# Altium schematic sheet Server_CPU_Reset_IO.SchDoc
size D
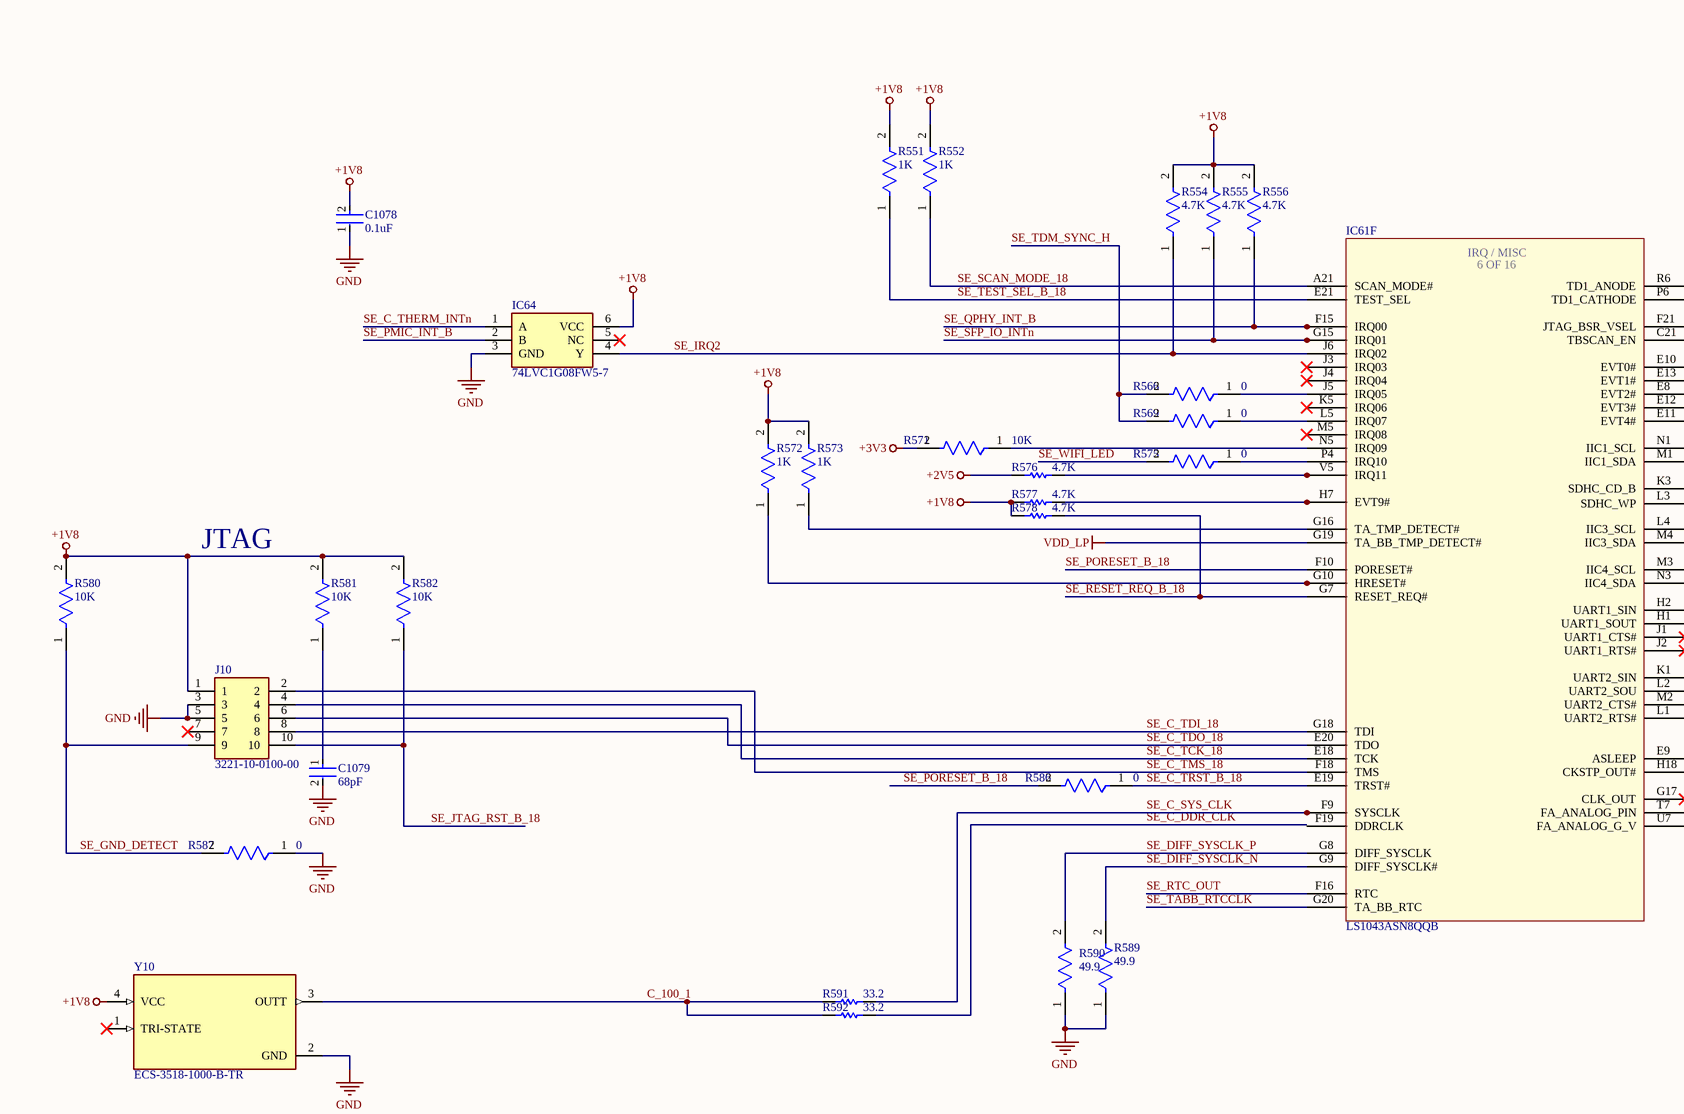
[diagram p0: Server_CPU_Reset_IO.SchDoc, top left]
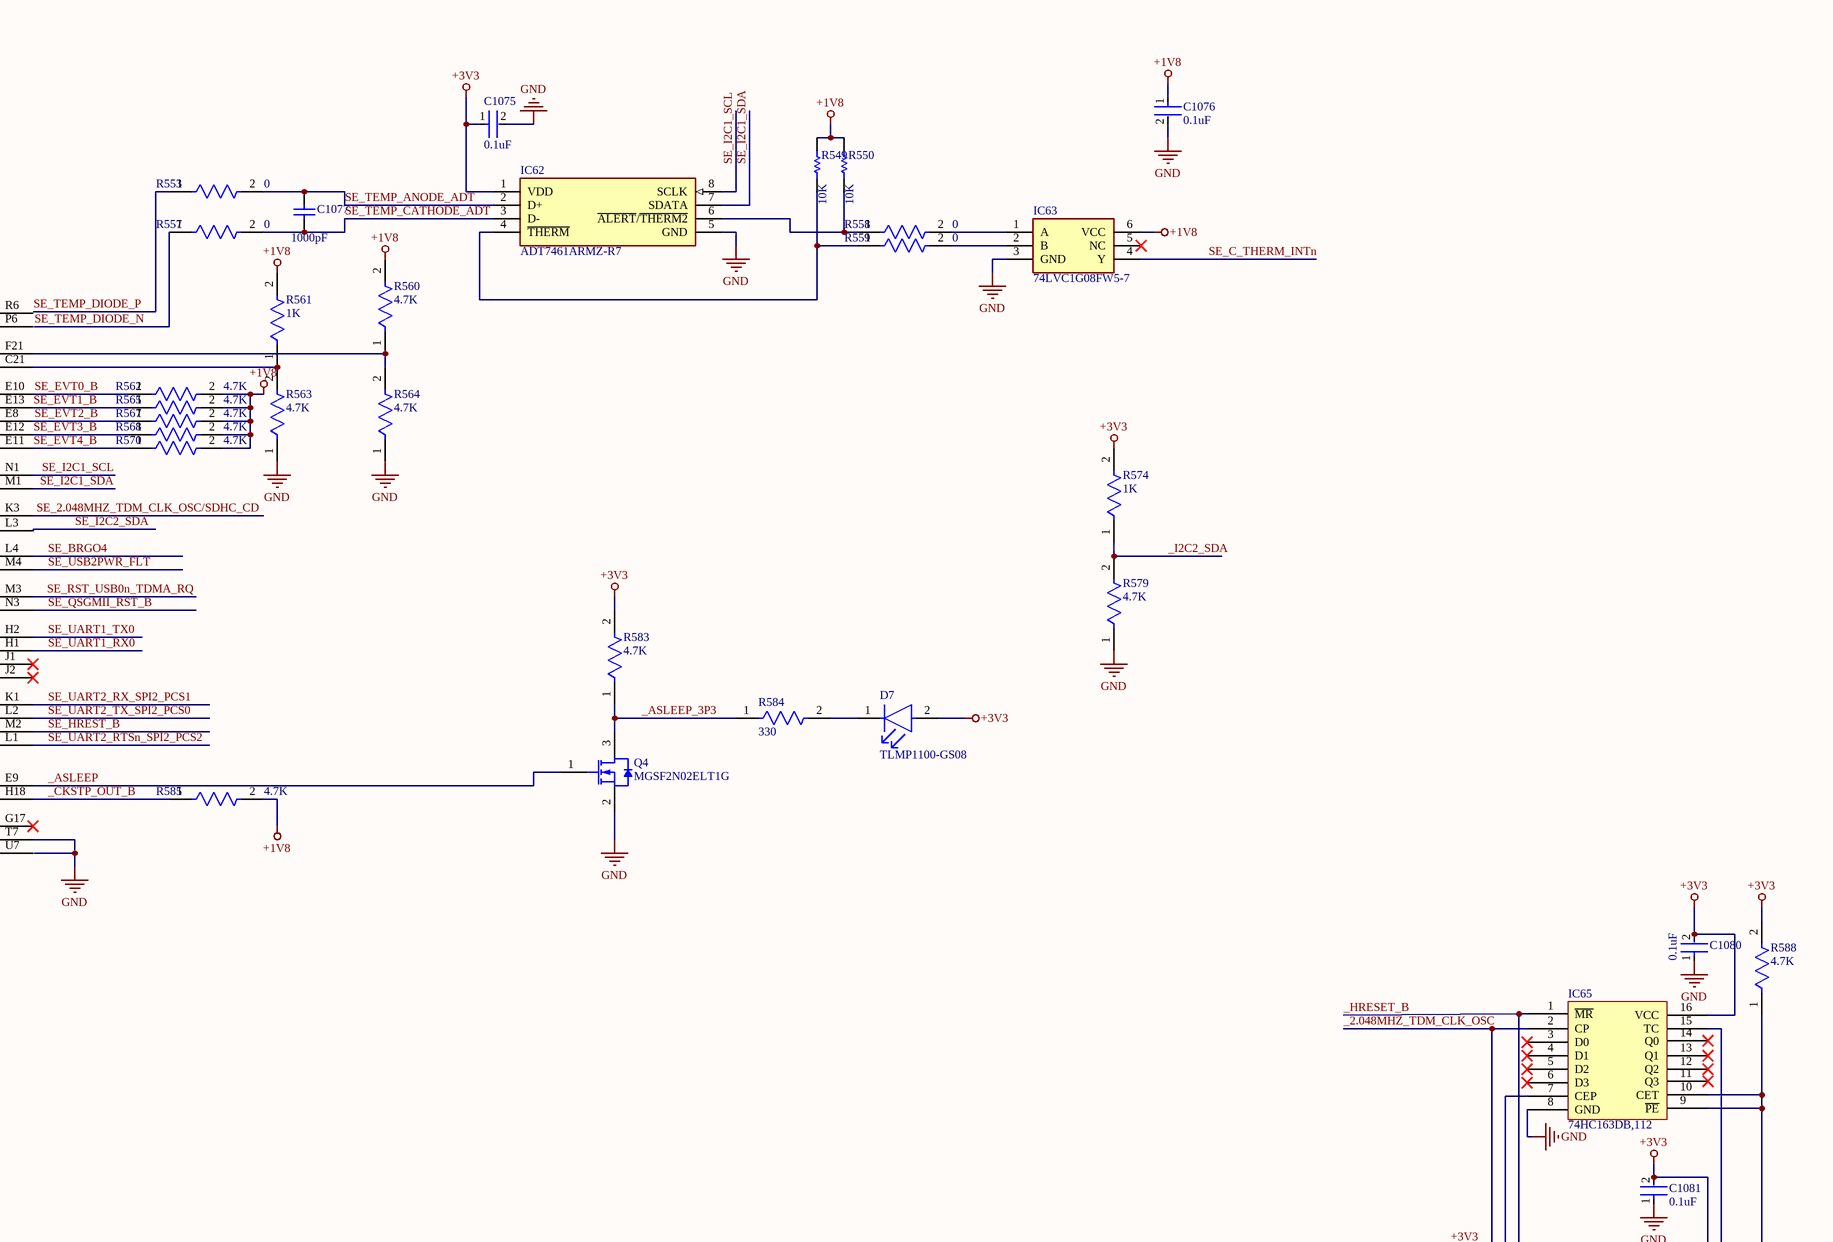
[diagram p1: Server_CPU_Reset_IO.SchDoc, top right]
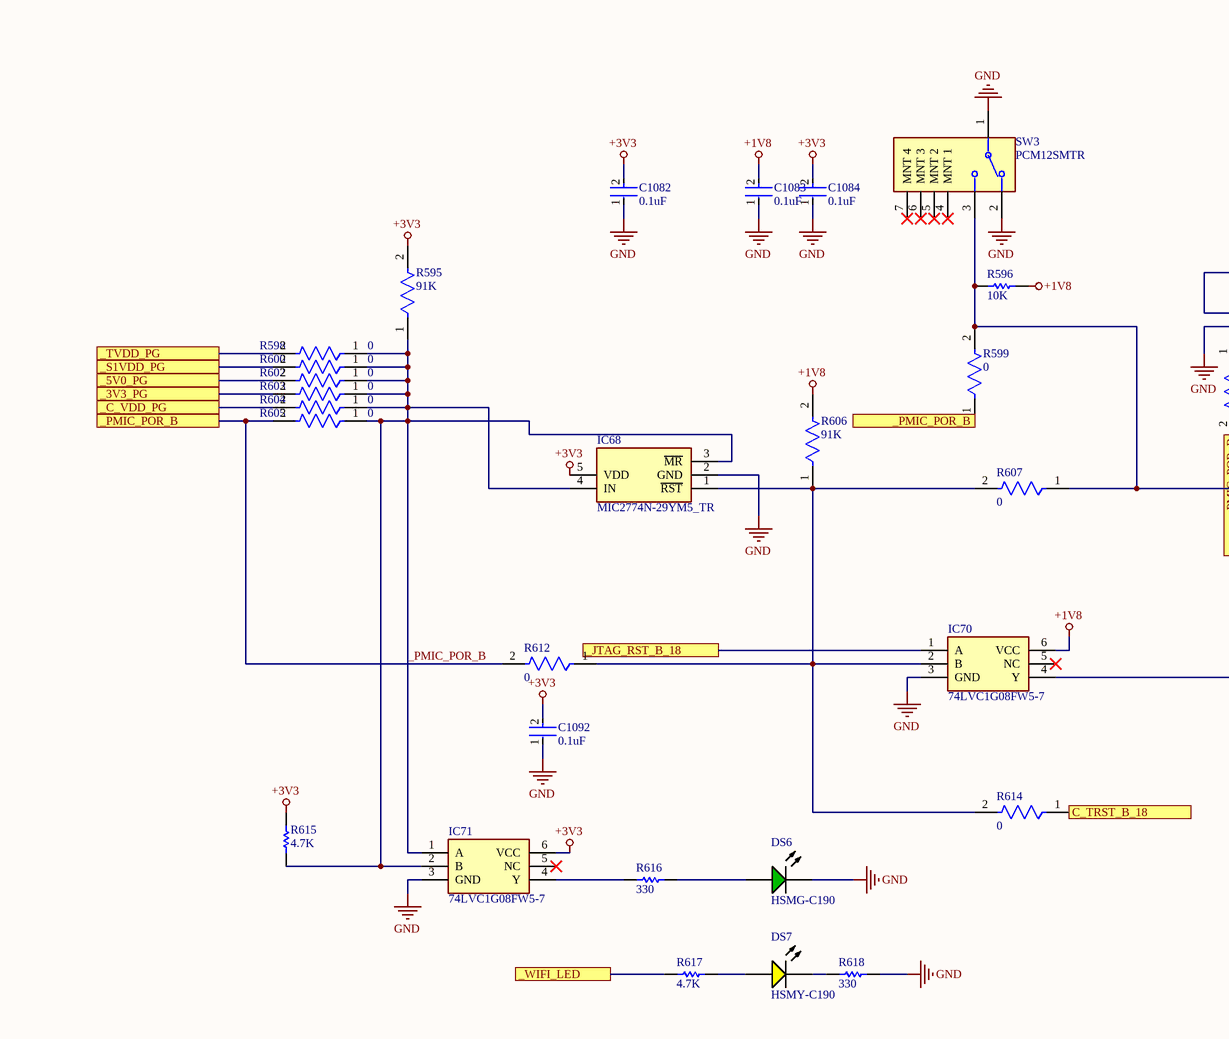
[diagram p2: Server_CPU_Reset_IO.SchDoc, bottom left]
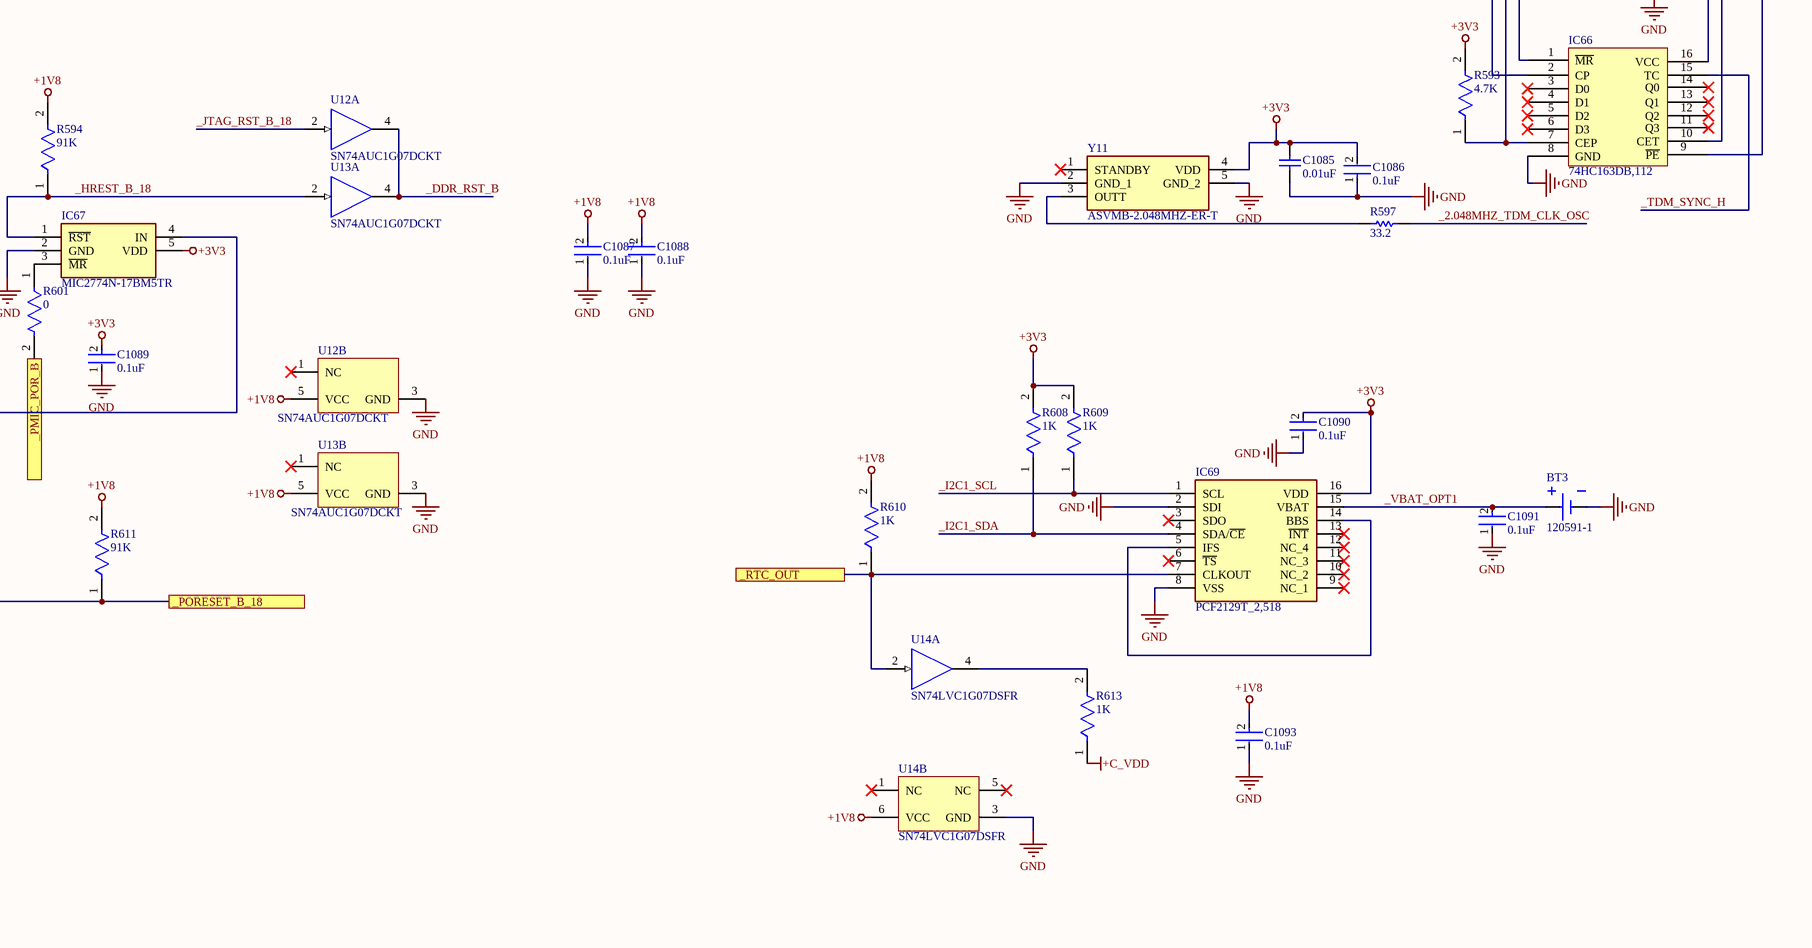
[diagram p3: Server_CPU_Reset_IO.SchDoc, bottom right]

## Parts
BT3  120591-1  [TECO-120591-1-2_V]
C1075  0.1uF  [FP-C0402-BB-MFG]
C1076  0.1uF  [FP-C0402-BB-MFG]
C1077  1000pF  [CAPC1005X55X25ML5T10]
C1078  0.1uF  [FP-GRM15-MFG]
C1079  68pF  [FP-C0805C-DN-MFG]
C1080  0.1uF  [FP-C0402-BB-MFG]
C1081  0.1uF  [FP-C0402-BB-MFG]
C1082  0.1uF  [FP-GRM15-MFG]
C1083  0.1uF  [FP-GRM15-MFG]
C1084  0.1uF  [FP-GRM15-MFG]
C1085  0.01uF  [CAPC1005X56X25LL10T15]
C1086  0.1uF  [FP-C0402-BB-MFG]
C1087  0.1uF  [FP-GRM15-MFG]
C1088  0.1uF  [FP-GRM15-MFG]
C1089  0.1uF  [FP-GRM15-MFG]
C1090  0.1uF  [FP-GRM15-MFG]
C1091  0.1uF  [FP-GRM15-MFG]
C1092  0.1uF  [FP-GRM15-MFG]
C1093  0.1uF  [FP-GRM15-MFG]
D7  TLMP1100-GS08  [FP-6_541-5056_01-4-MFG]
DS6  HSMG-C190  [AVAG-HSMX-C190_V]
DS7  HSMY-C190  [AVAG-HSMX-C190_V]
IC61  LS1043ASN8QQB  [BGA780C80P28X28_2300X2300X261]  (part F of 16)
IC62  ADT7461ARMZ-R7  [SOP65P490X110-8N]
IC63  74LVC1G08FW5-7  [74LVC1G08FW57]
IC64  74LVC1G08FW5-7  [74LVC1G08FW57]
IC65  74HC163DB,112  [SOP65P775X200-16N]
IC66  74HC163DB,112  [SOP65P775X200-16N]
IC67  MIC2774N-17BM5TR  [SOT95P280X145-5N]
IC68  MIC2774N-29YM5_TR  [SOT95P280X145-5N]
IC69  PCF2129T_2,518  [SOIC127P1032X265-16N]
IC70  74LVC1G08FW5-7  [74LVC1G08FW57]
IC71  74LVC1G08FW5-7  [74LVC1G08FW57]
J10  3221-10-0100-00  [CNC_3221-10-0100-00]
Q4  MGSF2N02ELT1G  [ONSC-SOT-23-3-318-08_V]
R549  10K  [RESC1005X40X25NL05T05]
R550  10K  [RESC1005X40X25NL05T05]
R551  1K  [FP-CRCW0402-e3-MFG]
R552  1K  [FP-CRCW0402-e3-MFG]
R553  0  [FP-CRCW0402-e3-IPC_C]
R554  4.7K  [FP-CRCW0402-e3-IPC_B]
R555  4.7K  [FP-CRCW0402-e3-IPC_B]
R556  4.7K  [FP-CRCW0402-e3-IPC_B]
R557  0  [FP-CRCW0402-e3-IPC_C]
R558  0  [FP-CRCW0402-e3-IPC_C]
R559  0  [FP-CRCW0402-e3-IPC_C]
R560  4.7K  [FP-CRCW0402-e3-IPC_B]
R561  1K  [FP-CRCW0402-e3-MFG]
R562  4.7K  [FP-CRCW0402-e3-IPC_B]
R563  4.7K  [FP-CRCW0402-e3-IPC_B]
R564  4.7K  [FP-CRCW0402-e3-IPC_B]
R565  4.7K  [FP-CRCW0402-e3-IPC_B]
R566  0  [FP-CRCW0402-e3-IPC_C]
R567  4.7K  [FP-CRCW0402-e3-IPC_B]
R568  4.7K  [FP-CRCW0402-e3-IPC_B]
R569  0  [FP-CRCW0402-e3-IPC_C]
R570  4.7K  [FP-CRCW0402-e3-IPC_B]
R571  10K  [FP-CRCW0402-e3-IPC_B]
R572  1K  [FP-CRCW0402-e3-MFG]
R573  1K  [FP-CRCW0402-e3-MFG]
R574  1K  [FP-CRCW0402-e3-MFG]
R575  0  [FP-CRCW0402-e3-IPC_C]
R576  4.7K  [RESC1005X40X25LL05T05]
R577  4.7K  [RESC1005X40X25LL05T05]
R578  4.7K  [RESC1005X40X25LL05T05]
R579  4.7K  [FP-CRCW0402-e3-IPC_B]
R580  10K  [FP-CRCW0402-e3-IPC_B]
R581  10K  [FP-CRCW0402-e3-IPC_B]
R582  10K  [FP-CRCW0402-e3-IPC_B]
R583  4.7K  [FP-CRCW0402-e3-IPC_B]
R584  330  [FP-CRCW0402-e3-MFG]
R585  4.7K  [FP-CRCW0402-e3-IPC_B]
R586  0  [FP-CRCW0402-e3-IPC_C]
R587  0  [FP-CRCW0402-e3-IPC_C]
R588  4.7K  [FP-CRCW0402-e3-IPC_B]
R589  49.9  [FP-CRCW0402-e3-MFG]
R590  49.9  [FP-CRCW0402-e3-MFG]
R591  33.2  [RESC1005X40X25LL05T05]
R592  33.2  [RESC1005X40X25LL05T05]
R593  4.7K  [FP-CRCW0402-e3-IPC_B]
R594  91K  [FP-CRCW0402-e3-IPC_B]
R595  91K  [FP-CRCW0402-e3-IPC_B]
R596  10K  [RESC1005X40X25NL05T05]
R597  33.2  [RESC1005X40X25ML05T05]
R598  0  [FP-CRCW0402-e3-IPC_C]
R599  0  [FP-CRCW0402-e3-IPC_C]
R600  0  [FP-CRCW0402-e3-IPC_C]
R601  0  [FP-CRCW0402-e3-IPC_C]
R602  0  [FP-CRCW0402-e3-IPC_C]
R603  0  [FP-CRCW0402-e3-IPC_C]
R604  0  [FP-CRCW0402-e3-IPC_C]
R605  0  [FP-CRCW0402-e3-IPC_C]
R606  91K  [FP-CRCW0402-e3-IPC_B]
R607  0  [FP-CRCW0402-e3-IPC_C]
R608  1K  [FP-CRCW0402-e3-MFG]
R609  1K  [FP-CRCW0402-e3-MFG]
R610  1K  [FP-CRCW0402-e3-MFG]
R611  91K  [FP-CRCW0402-e3-IPC_B]
R612  0  [FP-CRCW0402-e3-IPC_C]
R613  1K  [FP-CRCW0402-e3-MFG]
R614  0  [FP-CRCW0402-e3-IPC_C]
R615  4.7K  [RESC1005X40X25LL05T05]
R616  330  [RESC1608X55X30LL15T15]
R617  4.7K  [RESC1005X40X25LL05T05]
R618  330  [RESC1608X55X30LL15T15]
SW3  PCM12SMTR  [FP-PCM12SMTR-MFG]
U12  SN74AUC1G07DCKT  [DCK0005A_M]  (parts A,B of 2)
U13  SN74AUC1G07DCKT  [DCK0005A_M]  (parts A,B of 2)
U14  SN74LVC1G07DSFR  [DSF0006A_V]  (parts A,B of 2)
Y10  ECS-3518-1000-B-TR  [OSC_ECS-3518-1000-B-TR]
Y11  ASVMB-2.048MHZ-ER-T  [ASVMB2048MHZERT]

## Ports
_3V3_PG, _5V0_PG, _C_VDD_PG, _JTAG_RST_B_18, _PMIC_POR_B, _PORESET_B_18, _RTC_OUT, _S1VDD_PG, _TVDD_PG, _WIFI_LED, C_TRST_B_18

## Nets
+1V8: C1076.1 C1078.2 C1083.2 C1087.2 C1088.2 C1093.2 IC63.6(VCC) IC64.6(VCC) IC70.6(VCC) J10.1 R549.2 R550.2 R551.2 R552.2 R554.2 R555.2 R556.2 R560.2 R561.2 R562.2 R565.2 R567.2 R568.2 R570.2 R572.2 R573.2 R577.2 R578.2 R580.2 R581.2 R582.2 R585.2 R594.2 R596.1 R606.2 R610.2 R611.2 U12.5(VCC) U13.5(VCC) U14.6(VCC) Y10.4(VCC)
+2V5: R576.2
+3V3: C1075.1 C1080.2 C1081.2 C1082.2 C1084.2 C1085.2 C1086.2 C1089.2 C1090.2 C1092.2 D7.2(A) IC62.1(VDD) IC65.16(VCC) IC66.16(VCC) IC67.5(VDD) IC68.5(VDD) IC69.16(VDD) IC71.6(VCC) R571.2 R574.2 R583.2 R588.2 R593.2 R595.2 R608.2 R609.2 R615.2 Y11.4(VDD)
+C_VDD: R613.1
GND: BT3.2(-) C1075.2 C1076.2 C1078.1 C1079.2 C1080.1 C1081.1 C1082.1 C1083.1 C1084.1 C1085.1 C1086.1 C1087.1 C1088.1 C1089.1 C1090.1 C1091.1 C1092.1 C1093.1 DS6.2(K) IC61.T7(FA_ANALOG_PIN) IC62.5(GND) IC63.3(GND) IC64.3(GND) IC65.8(GND) IC66.8(GND) IC67.2(GND) IC68.2(GND) IC69.2(SDI) IC69.8(VSS) IC70.3(GND) IC71.3(GND) J10.3 J10.5 Q4.2(S) R563.1 R564.1 R579.1 R587.1 R589.1 R590.1 R618.2 SW3.1 SW3.2 U12.3(GND) U13.3(GND) U14.3(GND) Y10.2(GND) Y11.2(GND_1) Y11.5(GND_2)
VDD_LP: IC61.G19(TA_BB_TMP_DETECT#)
_2.048MHZ_TDM_CLK_OSC: IC65.2(CP) IC66.2(CP) R597.2
_3V3_PG: R603.2 ; port _3V3_PG
_5V0_PG: R602.2 ; port _5V0_PG
_ASLEEP: IC61.E9(ASLEEP) Q4.1(G)
_ASLEEP_3P3: Q4.3(D) R583.1 R584.1
_C_VDD_PG: R604.2 ; port _C_VDD_PG
_CKSTP_OUT_B: IC61.H18(CKSTP_OUT#) R585.1
_DDR_RST_B: U12.4(Y) U13.4(Y)
_HRESET_B: IC65.1(~{MR}) IC66.1(~{MR})
_HREST_B_18: IC67.1(~{RST}) R594.1 U13.2(A)
_I2C1_SCL: IC69.1(SCL) R609.1
_I2C1_SDA: IC69.4(SDA/~{CE}) R608.1
_I2C2_SDA: R574.1 R579.2
_JTAG_RST_B_18: IC70.1(A) ; port _JTAG_RST_B_18
_JTAG_RST_B_18: U12.2(A)  [a separate net that carries the same name]
_PMIC_POR_B: IC68.3(~{MR}) IC68.4(IN) IC71.1(A) IC71.2(B) R595.1 R598.1 R599.1 R600.1 R601.2 R602.1 R603.1 R604.1 R605.1 R605.2 R612.2 R615.1 ; port _PMIC_POR_B
_PORESET_B_18: IC70.4(Y) R611.1 ; port _PORESET_B_18
_RTC_OUT: IC69.7(CLKOUT) R610.1 U14.2(A) ; port _RTC_OUT
_S1VDD_PG: R600.2 ; port _S1VDD_PG
_TDM_SYNC_H: IC66.15(TC)
_TVDD_PG: R598.2 ; port _TVDD_PG
_VBAT_OPT1: BT3.1(+) C1091.2 IC69.15(VBAT)
_WIFI_LED: R617.2 ; port _WIFI_LED
C_100_1: R591.1 R592.1 Y10.3(OUTT)
C_TRST_B_18: R614.1 ; port C_TRST_B_18
SE_2.048MHZ_TDM_CLK_OSC/SDHC_CD: IC61.K3(SDHC_CD_B)
SE_BRGO4: IC61.L4(IIC3_SCL)
SE_C_DDR_CLK: R592.2
SE_C_SYS_CLK: IC61.F9(SYSCLK) R591.2
SE_C_TCK_18: IC61.E18(TCK) J10.4
SE_C_TDI_18: IC61.G18(TDI) J10.8
SE_C_TDO_18: IC61.E20(TDO) J10.6
SE_C_THERM_INTn: IC63.4(Y) IC64.1(A)
SE_C_TMS_18: IC61.F18(TMS) J10.2
SE_C_TRST_B_18: IC61.E19(TRST#) R586.1
SE_DIFF_SYSCLK_N: IC61.G9(DIFF_SYSCLK#) R589.2
SE_DIFF_SYSCLK_P: IC61.G8(DIFF_SYSCLK) R590.2
SE_EVT0_B: IC61.E10(EVT0#) R562.1
SE_EVT1_B: IC61.E13(EVT1#) R565.1
SE_EVT2_B: IC61.E8(EVT2#) R567.1
SE_EVT3_B: IC61.E12(EVT3#) R568.1
SE_EVT4_B: IC61.E11(EVT4#) R570.1
SE_GND_DETECT: J10.9 R580.1 R587.2
SE_HREST_B: IC61.M2(UART2_CTS#)
SE_I2C1_SCL: IC61.N1(IIC1_SCL) IC62.8(SCLK)
SE_I2C1_SDA: IC61.M1(IIC1_SDA) IC62.7(SDATA)
SE_I2C2_SDA: IC61.L3(SDHC_WP)
SE_IRQ2: IC61.J6(IRQ02) IC64.4(Y) R554.1
SE_JTAG_RST_B_18: J10.10 R582.1
SE_PMIC_INT_B: IC64.2(B)
SE_PORESET_B_18: IC61.F10(PORESET#) R586.2
SE_QPHY_INT_B: IC61.F15(IRQ00) R556.1
SE_QSGMII_RST_B: IC61.N3(IIC4_SDA)
SE_RESET_REQ_B_18: IC61.G7(RESET_REQ#) R578.1
SE_RST_USB0n_TDMA_RQ: IC61.M3(IIC4_SCL)
SE_RTC_OUT: IC61.F16(RTC)
SE_SCAN_MODE_18: IC61.A21(SCAN_MODE#) R552.1
SE_SFP_IO_INTn: IC61.G15(IRQ01) R555.1
SE_TABB_RTCCLK: IC61.G20(TA_BB_RTC)
SE_TDM_SYNC_H: R566.2 R569.2
SE_TEMP_ANODE_ADT: C1077.2 IC62.2(D+) R553.2
SE_TEMP_CATHODE_ADT: C1077.1 IC62.3(D-) R557.2
SE_TEMP_DIODE_N: R557.1
SE_TEMP_DIODE_P: R553.1
SE_TEST_SEL_B_18: IC61.E21(TEST_SEL) R551.1
SE_UART1_RX0: IC61.H1(UART1_SOUT)
SE_UART1_TX0: IC61.H2(UART1_SIN)
SE_UART2_RTSn_SPI2_PCS2: IC61.L1(UART2_RTS#)
SE_UART2_RX_SPI2_PCS1: IC61.K1(UART2_SIN)
SE_UART2_TX_SPI2_PCS0: IC61.L2(UART2_SOU)
SE_USB2PWR_FLT: IC61.M4(IIC3_SDA)
SE_WIFI_LED: R575.2
NetC1079_1: C1079.1 R581.1
NetD7_1: D7.1(C) R584.2
NetDS6_1: DS6.1(A) R616.2
NetDS7_1: DS7.1(A) R617.1
NetDS7_2: DS7.2(K) R618.1
NetIC61_C21: IC61.C21(TBSCAN_EN) R561.1 R563.2
NetIC61_F21: IC61.F21(JTAG_BSR_VSEL) R560.1 R564.2
NetIC61_G10: IC61.G10(HRESET#) R572.1
NetIC61_G16: IC61.G16(TA_TMP_DETECT#) R573.1
NetIC61_H7: IC61.H7(EVT9#) R577.1
NetIC61_J5: IC61.J5(IRQ05) R566.1
NetIC61_L5: IC61.L5(IRQ07) R569.1
NetIC61_N5: IC61.N5(IRQ09) R571.1
NetIC61_P4: IC61.P4(IRQ10) R575.1
NetIC61_V5: IC61.V5(IRQ11) R576.1
NetIC62_4: IC62.4(~{THERM}) R549.1 R559.1
NetIC62_6: IC62.6(~{ALERT}/~{THERM2}) R550.1 R558.1
NetIC63_1: IC63.1(A) R558.2
NetIC63_2: IC63.2(B) R559.2
NetIC65_7: IC65.7(CEP) IC66.7(CEP) R593.1
NetIC65_9: IC65.9(~{PE}) IC65.10(CET) IC66.9(~{PE}) R588.1
NetIC65_15: IC65.15(TC) IC66.10(CET)
NetIC67_3: IC67.3(~{MR}) R601.1
NetIC67_4: IC67.4(IN) R596.2 R599.2 R607.1 SW3.3
NetIC68_1: IC68.1(~{RST}) IC70.2(B) R606.1 R607.2 R612.1 R614.2
NetIC69_5: IC69.5(IFS) IC69.14(BBS)
NetIC71_4: IC71.4(Y) R616.1
NetR597_1: R597.1 Y11.3(OUTT)
NetR613_2: R613.2 U14.4(Y)

Not connected (* = marked no-connect by the designer): IC61 F19(DDRCLK) G17(CLK_OUT)* J1(UART1_CTS#)* J2(UART1_RTS#)* J3(IRQ03)* J4(IRQ04)* K5(IRQ06)* M5(IRQ08)* P6(TD1_CATHODE) R6(TD1_ANODE) U7(FA_ANALOG_G_V); IC63 5(NC)*; IC64 5(NC)*; IC65 3(D0)* 4(D1)* 5(D2)* 6(D3)* 11(Q3)* 12(Q2)* 13(Q1)* 14(Q0)*; IC66 3(D0)* 4(D1)* 5(D2)* 6(D3)* 11(Q3)* 12(Q2)* 13(Q1)* 14(Q0)*; IC69 3(SDO)* 6(~{TS})* 9(NC_1)* 10(NC_2)* 11(NC_3)* 12(NC_4)* 13(~{INT})*; IC70 5(NC)*; IC71 5(NC)*; J10 7*; SW3 4(MNT_1)* 5(MNT_2)* 6(MNT_3)* 7(MNT_4)*; U12 1(NC)*; U13 1(NC)*; U14 1(NC)* 5(NC)*; Y10 1(TRI-STATE)*; Y11 1(STANDBY)*

## Notes on the sheet
- JTAG
- Title
- Size:
- Date:
- File:
- D
- Number:
- Time:
- Revision:
- Sheet
- of
- (in symbol LS1043ASN8QQB, part F) IRQ / MISC; 6 OF 16

## Library data of the parts
BT3 = CMP-0438-00001-2: Lithium Battery Holder for CR2032 3V Cell; Manufacturer: TE Connectivity; Packing Type: Tray; Body Shape: Horizontal Cylindrical; AccessRights: 2147483647; RevisionId: 1; Folder: Unified Components\Components\TE Connectivity\Connectors & Connector Components\Power Products\Battery Interconnection Products\; ContentType: Unified Component; ContentTypeGUID: CB3C11C4-E317-11DF-B822-12313F0024A2; ComponentLink1Description: Manufacturer URL; LifeCycleStateGUID: 61E382EE-6656-4F12-9E24-BE9327104A25; FolderGUID: A6761B51-D489-48A3-9180-F4808F45AB79; PartNumber: 120591-1; LifeCycle: Released; ReleaseDate: 20/08/2013 02:50:22 AM; PackageReference: 120591-1; ComponentLink2URL: http://www.te.com/commerce/DocumentDelivery/DDEController?Action=showdoc&DocId=Customer+Drawing%7F120591%7FH%7Fpdf%7FEnglish%7FENG_CD_120591_H.pdf%7F120591-1; DatasheetVersion: Rev. H, 01/2013; PackageDescription: Lithium Battery Holder; ItemGUID: B2C50140-681E-4F62-8DBB-9728605318CE; ItemHRID: CMP-0438-00001; Mounting Technology: Through Hole; ComponentLink1URL: http://www.te.com/; ComponentLink2Description: Datasheet
C1075 C1076 C1080 C1081 C1086 = CMP-2008-02046-2: CAP CER 0.1UF 10V X5R 0402; Manufacturer: Kemet; Manufacturer Part Number: C0402C104K8PACTU; Material: Ceramic; Capacitance: 0.10 μF; Temperature Coefficient: 15%; Tolerance: 0.1; Value: 0.10 μF; Package: C0402-BB; Temperature: -55°C to +125°C; ComponentLink2Description: Datasheet; Temperature Characteristic: X5R; Device Class L1: Passive Components; Height: 0.55mm; Lead Free: Yes; ComponentLink2URL: https://content.kemet.com/datasheets/KEM_C1002_X7R_SMD.pdf; Device Class L2: Capacitors; Temperature Range Low: -55°C; Temperature Range High: +125°C; RoHS: TRUE; Octopart: https://octopart.com/c0402c104k8pactu-kemet-140039; Automotive: No; Mouser Description: Capacitor 100 nF 10 VDC 0402; Category: Cap; Voltage Rating: 10 V; Digikey Description: CAP CER 0.1UF 10V X5R 0402; Ipc Land Pattern Name: CAPC10050X50; Device Class L3: Ceramic Capacitors
C1077 = CMP-1662-00017-1: Chip Capacitor, 1 nF, +/- 10%, 50 V, -55 to 125 degC, 0402 (1005 Metric), RoHS, Tape and Reel; Case\/Package: 0402; Type (Capacitors): X7R; Voltage Rating (DC): 50 V; Capacitance: 1 nF; Width: 0.5 mm; Pins: 2; REACH SVHC: No SVHC; Length: 1 mm; Height: 0.5 mm; PackageDescription: 2-Pin Surface Mount Device, Body 1 x 0.5 mm; DatasheetVersion: 07/2016; Mount: Surface Mount; ComponentLink2Description: Datasheet; Tolerance: 10%; ComponentLink2URL: http://psearch.en.murata.com/capacitor/product/GRM155R71H102KA01%23.pdf; ComponentLink1URL: http://www.murata.com/; Case Code (Metric): 1005; Package Quantity: 10000; Min Operating Temperature: -55 degC; Max Operating Temperature: 125 degC; Voltage Rating: 50 V; ComponentLink1Description: Manufacturer URL; Packaging: Tape and Reel; Radiation Hardening: No; RoHSCompliant: true; PackageReference: 0402; Mounting Technology: Surface Mount; Case Code (Imperial): 0402
C1078 C1082-C1084 C1087-C1093 = CMP-2100-03641-2: CAP CER 0.1UF 16V X7R 0402; Manufacturer Part Number: GRM155R71C104KA88D; Manufacturer: Murata; Standoff Height: 0mm; Tolerance: 10%; Voltage Rating: 16Vdc; Material: Ceramic; Capacitance: 0.10μF; Value: 0.10μF; RoHS: TRUE; Temperature Characteristic: X7R; Octopart: https://octopart.com/grm155r71c104ka88d-murata-196880; Digikey Description: CAP CER 0.1UF 16V X7R 0402; Device Class L3: Ceramic Capacitors; Height: 0.55mm; ComponentLink2Description: Datasheet; Temperature Range Low: -55°C; Ipc Land Pattern Name: CAPC10050X219; ComponentLink2URL: https://search.murata.co.jp/Ceramy/image/img/A01X/G101/ENG/GRM155R71H471KA01-01A.pdf; Device Class L1: Passive Components; Lead Free: yes; Category: Cap; Package: GRM15; Temperature: -55°C to +125°C; Device Class L2: Capacitors; Temperature Range High: +125°C; Mouser Description: 0402 0.1 uF 16V ±10 % Tolerance X7R SMT Multilayer Ceramic Capacitor
C1079 = CMP-2007-00438-2: CAP CER 68PF 50V C0G/NP0 0805; Manufacturer Part Number: C0805C680J5GACTU; Manufacturer: KEMET; Temperature Coefficient: 30ppm/°C; Tolerance: 0.05; Temperature Characteristic: C0G; Material: Ceramic; ComponentLink2URL: https://content.kemet.com/datasheets/KEM_C1003_C0G_SMD.pdf; Device Class L1: Passive Components; Device Class L2: Capacitors; Capacitance: 68 pF; Value: 68 pF; Category: Cap; Octopart: https://octopart.com/c0805c680j5gactu-kemet-130145; Digikey Description: CAP CER 68PF 50V C0G/NP0 0805; Voltage Rating: 50 V; Ipc Land Pattern Name: CAPC200125X78; Lead Free: Yes; RoHS: TRUE; Device Class L3: Ceramic Capacitors; Mouser Description: Multilayer Ceramic Capacitors MLCC - SMD/SMT 50volts 68pF C0G 5%; Temperature Range High: +125°C; Temperature Range Low: -55°C; Height: 0.88mm; Temperature: -55°C to +125°C; ComponentLink2Description: Datasheet; Automotive: No; Package: C0805C-DN
C1085 = CMP-2008-02796-1: Manufacturer: AVX Interconnect / Elco; Part Number: 0402YC103JAT2A
D7 = CMP-02520-000009-1: LED GREEN 0603 SMD; Manufacturer: Vishay; Max Junction Temp: +120°C; Automotive Grade: Grade 3; Reverse Voltage: 6V; Led Orientation: Top View; Forward Voltage: 2.1V; Luminous Intensity: 15mcd; Forward Current: 20mA; Colour: Pure green; Peak Emmision Wavelength: 562nm; Wavelength: 561nm; Viewing Angle: 160°; Power Dissipation: 90mW; Digikey Description: LED GREEN 0603 SMD; Package: 6.541-5056.01-4; Ambient Temperature Range High: +100°C; Height: 0.65mm; Device Class L1: Optoelectronics; Device Class L2: LEDs; Mouser Description: Standard LEDs - SMD Pure Green; Temperature Range High: +120°C; RoHS: TRUE; Ambient Temperature Range Low: -40°C; Temperature: to +120°C; Manufacturer Part Number: TLMP1100-GS08; ComponentLink2URL: http://www.vishay.com/docs/83173/tlmb1100.pdf; Lead Free: Yes; Octopart: https://octopart.com/tlmp1100-gs08-vishay-55433993; Automotive: Yes; Device Class L3: unset; ComponentLink2Description: Datasheet; Category: Diode
DS6 = CMP-1744-00002-1: Chip LED, Green, 2.2 V, -40 to 85 degC, 2-Pin SMD, RoHS, Tape and Reel; Frequency: 400 KHz; Max Supply Voltage: 5.5 V; Access Time: 3500 ns; Clock Frequency: 100 KHz; Case\Package: SOIC; Density: 32 kb; Nominal Supply Current: 2 mA; Interface: Serial; Min Supply Voltage: 1.7 V; Packaging: Tape and Reel; PackageReference: HSMX-C190; ComponentLink2URL: http://docs.avagotech.com/docs/AV02-0551EN; RoHSCompliant: true; Pins: 8; REACH SVHC: No SVHC; Max Operating Temperature: 85 degC; Width: 4 mm; Radiation Hardening: No; Package Quantity: 3000; ComponentLink3Description: Package Specification; ComponentLink1Description: Manufacturer URL; Min Operating Temperature: -40 degC; PackageDescription: 2-Pin Surface Mount Device, Body 1.6 x 0.8 mm, Height 0.9 mm; Max Clock Frequency: 100 KHz; Height: 1.5 mm; ComponentLink1URL: http://www.avagotech.com/; DatasheetVersion: Mar-12; ComponentLink2Description: Datasheet; Mount: Surface Mount; Length: 5 mm; ComponentLink3URL: http://www.fairchildsemi.com/dwg/MA/MA03D.pdf
DS7 = CMP-1744-00003-1: LED Uni-Color Yellow, 65 mW, 20 mA, -40 to 85 degC, 2-Pin SMD, RoHS, Tape and Reel; Tolerance: 1%; Voltage Rating: 50 V; Power Rating: 100 mW; Case\Package: 0603; Resistance: 390 Ohm; Min Operating Temperature: -55 degC; Length: 1.6 mm; ComponentLink3Description: Package Specification; Mount: Surface Mount; PackageReference: HSMX-C190; ComponentLink2Description: Datasheet; DatasheetVersion: Mar-12; Case Code (Metric): 1608; Pins: 2; Package Quantity: 5000; ComponentLink2URL: http://docs.avagotech.com/docs/AV02-0551EN; ComponentLink1Description: Manufacturer URL; RoHSCompliant: true; Packaging: Tape and Reel; PackageDescription: 2-Pin Surface Mount Device, Body 1.6 x 0.8 mm, Height 0.9 mm; REACH SVHC: No SVHC; ComponentLink3URL: http://www.fairchildsemi.com/dwg/MA/MA03D.pdf; Voltage Rating (DC): 50 V; Width: 0.8 mm; ComponentLink1URL: http://www.avagotech.com/; Max Operating Temperature: 155 degC; Case Code (Imperial): 0603; Height: 0.45 mm
IC61 = LS1043ASN8QQB: Integrated Circuit; Manufacturer_Name: NXP; Datasheet Link: http://www.nxp.com/secured/assets/documents/en/data-sheet/LS1088A.pdf; Height: 2.61mm; Manufacturer_Part_Number: LS1043ASN8QQB; Mouser Part Number: 771-LS1043ASN8QQB; Mouser Price/Stock: https://www.mouser.co.uk/ProductDetail/NXP-Semiconductors/LS1043ASN8QQB/?qs=AQlKX63v8RsTATOTx7X0Jg%3D%3D
IC62 = ADT7461ARMZ-R7: Integrated Circuit; Manufacturer_Name: ON Semiconductor; Datasheet Link: http://www.onsemi.com/pub/Collateral/ADT7461-D.PDF; Height: 1.1mm; Manufacturer_Part_Number: ADT7461ARMZ-R7; Mouser Part Number: 863-ADT7461ARMZ-R7; Mouser Price/Stock: https://www.mouser.co.uk/ProductDetail/ON-Semiconductor/ADT7461ARMZ-R7/?qs=t2BMfLoP1KTcbdCoNjA9Gw%3D%3D; Arrow Part Number: ADT7461ARMZ-R7; Arrow Price/Stock: https://www.arrow.com/en/products/adt7461armz-r7/on-semiconductor
IC63 IC64 IC70 IC71 = 74LVC1G08FW5-7: Integrated Circuit; Manufacturer_Name: Diodes Inc.; Datasheet Link: https://www.diodes.com/assets/Datasheets/74LVC1G08.pdf; Height: 0.5mm; Manufacturer_Part_Number: 74LVC1G08FW5-7; Mouser Part Number: 621-74LVC1G08FW5-7; Mouser Price/Stock: https://www.mouser.co.uk/ProductDetail/Diodes-Incorporated/74LVC1G08FW5-7?qs=mYAa4mSiDJyHmkX79TXrAg%3D%3D; Arrow Part Number: 74LVC1G08FW5-7; Arrow Price/Stock: https://www.arrow.com/en/products/74lvc1g08fw5-7/diodes-incorporated
IC65 IC66 = 74HC163DB,112: Integrated Circuit; Manufacturer_Name: Nexperia; Datasheet Link: https://assets.nexperia.com/documents/data-sheet/74HC_HCT163.pdf; Height: 2mm; Manufacturer_Part_Number: 74HC163DB,112; Mouser Part Number: 771-HC163DB112; Mouser Price/Stock: https://www.mouser.com/Search/Refine.aspx?Keyword=771-HC163DB112; Arrow Part Number: 74HC163DB,112; Arrow Price/Stock: https://www.arrow.com/en/products/74hc163db112/nexperia
IC67 = MIC2774N-17BM5TR: Integrated Circuit; Manufacturer_Name: Microchip; Datasheet Link: http://ww1.microchip.com/downloads/en/DeviceDoc/mic2774.pdf; Height: 1.45mm; Manufacturer_Part_Number: MIC2774N-17BM5TR
IC68 = MIC2774N-29YM5_TR: Integrated Circuit; Manufacturer_Name: Microchip; Manufacturer_Part_Number: MIC2774N-29YM5 TR; Datasheet Link: https://eu.mouser.com/datasheet/2/268/mic2774-1891105.pdf; Height: 1.45mm
IC69 = PCF2129T_2,518: Integrated Circuit; Manufacturer_Name: NXP; Manufacturer_Part_Number: PCF2129T/2,518; Datasheet Link: http://www.nxp.com/docs/en/data-sheet/PCF2129.pdf; Height: 2.65mm; Mouser Part Number: 771-PCF2129T/2,518; Mouser Price/Stock: https://www.mouser.co.uk/ProductDetail/NXP-Semiconductors/PCF2129T-2518/?qs=O0BhuZj9Wkzo98h9NloC7Q%3D%3D; Arrow Part Number: PCF2129T/2,518; Arrow Price/Stock: https://www.arrow.com/en/products/pcf2129t2518/nxp-semiconductors
J10 = 3221-10-0100-00: Idc Box Header .050" 10pos; MF: {'manufacturer': u'CNC Tech'}; Value: *; Package: None; Price: None; MP: 3221-10-0100-00; Availability: Unavailable
Q4 = CMP-1058-00775-1: Power MOSFET, 2.8 A, 20 V, N-Channel, 3-Pin SOT-23, Pb-Free, Tape and Reel; Manufacturer: On Semiconductor; Crss Typ (pF): 45; Configuration: Single; V(BR)DSS Min (V): 20; ID Max (A): 2.8; Channel Polarity: N Channel; Ciss Typ (pF): 150; PD Max (W): 1.25; VGS Max (V): 8; Qrr Typ (nC): 200; Coss Typ (pF): 130; VGS(th) Max (V): 1; PartNumber: MGSF2N02ELT1G; ComponentLink3Description: Package Specification; ComponentLink1URL: http://www.onsemi.com/; ComponentLink3URL: http://www.onsemi.cn/pub_link/Collateral/318-08.PDF; DatasheetVersion: Rev. 3; Mounting Technology: Surface Mount; PackageVersion: Rev. AP, 11/2009; PackageDescription: 3-Pin Small Outline Transistor, Body 2.92 x 1.3 mm, Pitch 0.95 mm; ComponentLink1Description: Manufacturer URL; ComponentLink2URL: http://www.onsemi.cn/pub_link/Collateral/MGSF2N02EL-D.PDF; RoHS: Pb-Free; ComponentLink2Description: Datasheet; PackageReference: SOT-23-3-318-08; Package Type: SOT-23-3; Packing: Tape and Reel
R549 R550 = CMP-2002-01183-1: Part Number: ERT-J0ER103J; Manufacturer: Panasonic
R551 R552 R561 R572-R574 R608-R610 R613 = CMP-2002-08276-2: RES Thick Film, 1kΩ, 1%, 0.063W, 100ppm/°C, 0402; Resistance: 1kR; Power Rating: 63mW; Voltage Rating (DC): 50V; Package Quantity: 10; Termination: SMD/SMT; Width: 0.5mm; Military Standard: Not; Length: 1mm; Contact Plating: Tin; Mount: Surface Mount; Packaging: Tape and Reel; Case Code (Imperial): 0402; Tolerance: 1%; Weight: 2.3E-05oz; Number of Pins: 2; Case/Package: 0402; Case Code (Metric): 1005; Lead Free: Lead Free; Number of Terminations: 2; Max Power Dissipation: 63mW; Depth: 0.5mm; Temperature Coefficient: 100ppm/°C; Max Operating Temperature: 155°C; Height: 0.35mm; Features: Automotive AEC-Q200; Composition: Thick Film; Radiation Hardening: No; Voltage Rating: 50V; Min Operating Temperature: -55°C
R553 R557-R559 R566 R569 R575 R586 R587 R598-R605 R607 R612 R614 = CMP-2002-08122-2: RES Thick Film, 0Ω, 0.063W, 0402; Tolerance: 5%; Max Power Dissipation: 63mW; Voltage Rating: 50V; Temperature Coefficient: 100ppm/°C; Resistance: 0mR; Contact Plating: Tin; Height: 0.35mm; Radiation Hardening: No; Features: Automotive AEC-Q200; Composition: Thick Film; Width: 0.5mm; Weight: 2.3E-05oz; Termination: SMD/SMT; Packaging: Tape and Reel; Mount: Surface Mount; Case Code (Metric): 1005; Military Standard: Not; Min Operating Temperature: -55°C; Number of Terminations: 2; Package Quantity: 1; Case Code (Imperial): 0402; Depth: 0.5mm; Max Operating Temperature: 155°C; Case/Package: 0402; Power Rating: 63mW; Lead Free: Lead Free; Voltage Rating (DC): 50V; Length: 1mm
R554-R556 R560 R562-R565 R567 R568 R570 R579 R583 R585 R588 R593 = CMP-2002-00051-3: RES Thick Film, 4.7kΩ, 1%, 0.063W, 100ppm/°C, 0402; Voltage Rating (DC): 50V; Power Rating: 63mW; Resistance: 4.7kR; Termination: SMD/SMT; Military Standard: Not; Length: 1mm; Radiation Hardening: No; Max Operating Temperature: 155°C; Min Operating Temperature: -55°C; Package Quantity: 10; Width: 0.5mm; Case Code (Imperial): 0402; Number of Terminations: 2; Max Power Dissipation: 63mW; Tolerance: 1%; Features: Automotive AEC-Q200; Composition: Thick Film; Depth: 0.5mm; Mount: Surface Mount; Weight: 2.3E-05oz; Lead Free: Lead Free; Case/Package: 0402; Height: 0.35mm; Packaging: Tape and Reel; Temperature Coefficient: 100ppm/°C; Case Code (Metric): 1005; Voltage Rating: 50V; Contact Plating: Tin
R571 R580-R582 = CMP-2002-08136-3: RES Thick Film, 10kΩ, 5%, 0.063W, 200ppm/°C, 0402; Voltage Rating: 50V; Power Rating: 63mW; Resistance: 10kR; Military Standard: Not; Packaging: Tape and Reel; Case Code (Imperial): 0402; Min Operating Temperature: -55°C; Case Code (Metric): 1005; Case/Package: 0402; Temperature Coefficient: 200ppm/°C; Termination: SMD/SMT; Composition: Thick Film; Depth: 0.5mm; Number of Terminations: 2; Contact Plating: Tin; Height: 0.016inch; Width: 0.5mm; Max Operating Temperature: 155°C; Features: Automotive AEC-Q200; Length: 1mm; Radiation Hardening: No; Max Power Dissipation: 63mW; Mount: Surface Mount; Tolerance: 5%; Package Quantity: 1; Weight: 2.3E-05oz
R576-R578 R615 R617 = CMP-2002-01154-4: Chip Resistor, 4.7 KOhm, +/- 1%, 0.1 W, -55 to 155 degC, 0402 (1005 Metric), RoHS, Tape and Reel; PartNumber: ERJ-2RKF4701X; Voltage Rating: 50 V; Case\/Package: 0402; Power Rating: 100 mW; Height: 0.35 mm; Mounting Technology: Surface Mount; REACH SVHC: Yes; Resistance: 4.7 KOhm; Max Operating Temperature: 155 degC; ComponentLink1Description: Manufacturer URL; ComponentLink2Description: Datasheet; Pins: 2; PackageReference: 0402; Tolerance: 1%; Case Code (Imperial): 0402; Length: 1 mm; PackageDescription: 2-Pin Surface Mount Device, Body 1 x 0.5 mm; RoHSCompliant: true; Package Quantity: 1; Radiation Hardening: No; DatasheetVersion: 04/2015; Width: 0.5 mm; Case Code (Metric): 1005; Mount: Surface Mount; ComponentLink1URL: http://www.panasonic.com/; Min Operating Temperature: -55 degC; Packaging: Cut Tape; ComponentLink2URL: http://industrial.panasonic.com/cdbs/www-data/pdf/RDA0000/AOA0000C86.pdf
R584 = CMP-2002-08523-2: RES Thick Film, 330Ω, 1%, 0.063W, 100ppm/°C, 0402; Max Power Dissipation: 63mW; Voltage Rating (DC): 50V; Resistance: 330R; Case/Package: 0402; Packaging: Tape and Reel; Width: 0.5mm; Case Code (Metric): 1005; Radiation Hardening: No; Military Standard: Not; Contact Plating: Tin; Temperature Coefficient: 100ppm/°C; Lead Free: Lead Free; Power Rating: 63mW; Voltage Rating: 50V; Tolerance: 1%; Features: Automotive AEC-Q200; Case Code (Imperial): 0402; Composition: Thick Film; Weight: 2.3E-05oz; Package Quantity: 10; Min Operating Temperature: -55°C; Height: 0.35mm; Length: 1mm; Termination: SMD/SMT; Number of Terminations: 2; Depth: 0.5mm; Max Operating Temperature: 155°C
R589 R590 = CMP-1011-00363-3: RES Thick Film, 49.9Ω, 1%, 0.063W, 100ppm/°C, 0402; Resistance: 49.9R; Voltage Rating: 50V; Power Rating: 63mW; Temperature Coefficient: 100ppm/°C; Packaging: Tape and Reel; Height: 0.35mm; Length: 1mm; Case Code (Metric): 1005; Weight: 2.3E-05oz; Case Code (Imperial): 0402; Voltage Rating (DC): 50V; Composition: Thick Film; Lead Free: Lead Free; Package Quantity: 10; Number of Terminations: 2; Width: 0.5mm; Max Operating Temperature: 155°C; Depth: 0.5mm; Max Power Dissipation: 63mW; Tolerance: 1%; Radiation Hardening: No; Features: Automotive AEC-Q200; Min Operating Temperature: -55°C; Contact Plating: Tin; Mount: Surface Mount; Military Standard: Not; Termination: SMD/SMT; Case/Package: 0402
R591 R592 = CMP-2002-08532-1: Part Number: CRCW040233R2FKED; Manufacturer: Vishay Dale
R594 R595 R606 R611 = CMP-2002-00270-2: RES Thick Film, 91kΩ, 1%, 0.063W, 100ppm/°C, 0402; Power Rating: 63mW; Voltage Rating: 50V; Resistance: 91kR; Packaging: Tape and Reel; Max Operating Temperature: 155°C; Height: 0.35mm; Radiation Hardening: No; Tolerance: 1%; Number of Terminations: 2; Width: 0.02inch; Length: 1mm; Temperature Coefficient: 100ppm/°C; Features: Automotive AEC-Q200; Voltage Rating (DC): 50V; Weight: 2.3E-05oz; Min Operating Temperature: -55°C; Military Standard: Not; Max Power Dissipation: 63mW; Number of Pins: 2; Composition: Thick Film; Lead Free: Lead Free; Contact Plating: Tin; Case/Package: 0402; Termination: SMD/SMT; Package Quantity: 10; Case Code (Metric): 1005; Case Code (Imperial): 0402; Depth: 0.5mm
R596 = CMP-2002-08143-1: Part Number: CRCW040210R0FKED; Manufacturer: Vishay Dale
R597 = CMP-2002-08529-1: Manufacturer: Vishay Dale; Part Number: CRCW040233K2FKED
R616 R618 = CMP-2000-00435-2: Chip Resistor, 330 Ohm, +/- 1%, 0.1 W, -55 to 155 degC, 0603 (1608 Metric), RoHS, Tape and Reel; Gender: Male; Mating Cycles: 10000; Current Rating: 500 mA; Voltage Rating: 10 V; REACH SVHC: No SVHC; PackageDescription: 2-Pin Surface Mount Device, Body 1.6 x 0.85 mm; Contact Finish: Gold; Pins: 8; ComponentLink1Description: Manufacturer URL; Packaging: Tape and Reel; Max Operating Temperature: 85 degC; Contact Material: Copper; Height: 1.45 mm; Width: 1.45 mm; DatasheetVersion: Apr-15; Package Quantity: 1500; Contact Plating: Gold; PackageReference: 0603; Mount: Surface Mount; Lead Pitch: 1.1 mm; Min Operating Temperature: -25 degC; ComponentLink1URL: http://www.panasonic.com/; ComponentLink2URL: http://industrial.panasonic.com/cdbs/www-data/pdf/RDA0000/AOA0000C86.pdf; Length: 13.7 mm; ComponentLink2Description: Datasheet; RoHSCompliant: true
SW3 = CMP-2000-06884-2: SWITCH SLIDE SPDT 300MA 6V; Actuator Material: Nylon; Switch Function: On-On; Insulation Resistance: 100mR; Actuator Type: Standard; Mechanical Life: 10000Cycles; Actuator Length: 1.5mm; Contact Resistance: 70mR; Min Operating Temperature: -20°C; Max Current Rating: 300mA; Max Voltage Rating (DC): 6V; Package Quantity: 1; Mount: Surface Mount; Packaging: Tape and Reel; Contact Plating: Silver; Depth: 5mm; REACH SVHC: No SVHC; Voltage Rating (DC): 6V; Voltage Rating (AC): 6V; Max Operating Temperature: 85°C; Length: 7.7mm; Termination: Gull Wing; Current Rating: 300mA; Contact Current Rating: 300mA; Orientation: Right Angle; Width: 6.7mm; Switch Travel: 1.5mm; Lead Free: Lead Free; Contact Material: Copper Alloy; Throw Configuration: SPDT
U12 U13 = CMP-0859-00406-3: Single Buffer/Driver With Open-Drain Output, DCK0005A, SMALL T&R; Manufacturer: Texas Instruments; Input Type: CMOS; F @ Nom Voltage(Max)(Mhz): 250; Rating: Catalog; Bits(#): 1; Schmitt Trigger: No; VCC(Min)(V): 0.8; tpd @ Nom Voltage(Max)(ns): 4.7,3.3,2.4,2.3,1.8; Output Drive (IOL/IOH)(Max)(mA): 9/-9; VCC(Max)(V): 2.7; Technology Family: AUC; ICC @ Nom Voltage(Max)(mA): 0.01; Voltage(Nom)(V): 0.8,1.2,1.5,1.8,2.5; Sub-Family: Non-Inverting Buffer/Driver; Logic: True; DatasheetVersion: SCES373Q; 3-State Output: No; Operating Temperature Range(C): -40 to 85; Generic Part Number: SN74AUC1G07; PackageReference: DCK0005A; Output Type: CMOS
U14 = CMP-0859-00960-3: Single Buffer/Driver With Open-Drain Output, DSF0006A, LARGE T&R; Manufacturer: Texas Instruments; Output Type: CMOS; 3-State Output: No; F @ Nom Voltage(Max)(Mhz): 150; Bits(#): 1; Rating: Catalog; Voltage(Nom)(V): 1.8,2.5,3.3,5; Sub-Family: Non-Inverting Buffer/Driver; Input Type: CMOS/TTL; VCC(Max)(V): 5.5; Logic: True; VCC(Min)(V): 1.65; Output Drive (IOL/IOH)(Max)(mA): 32/-32; ICC @ Nom Voltage(Max)(mA): 0.01; Technology Family: LVC; tpd @ Nom Voltage(Max)(ns): 8.6,6,4.7,4; Schmitt Trigger: No; Operating Temperature Range(C): -40 to 125,-40 to 85; DatasheetVersion: SCES296AC; Generic Part Number: SN74LVC1G07; PackageReference: DSF0006A
Y10 = ECS-3518-1000-B-TR: subminiature SMD oscillators; MF: {'manufacturer': u'ECS Inc.'}; Price: None; MP: ECS-3518-1000-B-TR; Availability: Unavailable; Value: *; Package: None
Y11 = ASVMB-2.048MHZ-ER-T: Crystal or Oscillator; Manufacturer_Name: ABRACON; Datasheet Link: https://abracon.com/Oscillators/ASVMB.pdf; Height: 0.9mm; Manufacturer_Part_Number: ASVMB-2.048MHZ-ER-T